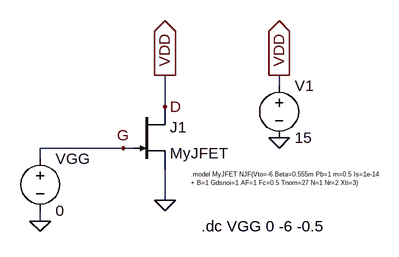
[diagram p0: schematic 004 JFET.asc]
004 JFET.asc, the LTspice schematic file:
Version 4
SHEET 1 2736 680
WIRE 352 0 352 -16
WIRE 176 32 176 -16
WIRE 112 96 -16 96
WIRE 128 96 112 96
WIRE -16 112 -16 96
WIRE 176 176 176 128
WIRE -16 208 -16 192
FLAG -16 208 0
FLAG 352 80 0
FLAG 176 32 D
FLAG 112 96 G
FLAG 176 176 0
FLAG 352 -16 VDD
IOPIN 352 -16 Out
FLAG 176 -16 VDD
IOPIN 176 -16 Out
SYMBOL voltage 352 -16 R0
SYMATTR InstName V1
SYMATTR Value 15
SYMBOL njf 128 32 R0
SYMATTR InstName J1
SYMATTR Value MyJFET
SYMBOL voltage -16 96 R0
SYMATTR InstName VGG
SYMATTR Value 0
TEXT 232 216 Left 2 !.dc VGG 0 -6 -0.5
TEXT 216 136 Left 0 !.model MyJFET NJF(Vto=-6 Beta=0.555m Pb=1 m=0.5 Is=1e-14\n+ B=1 Gdsnoi=1 AF=1 Fc=0.5 Tnom=27 N=1 Nr=2 Xti=3)

The netlist it stands for:
* 004 JFET.asc
V1 VDD 0 15
J1 VDD G 0 MyJFET
VGG G 0 0
.model NJF NJF
.model PJF PJF
.lib standard.jft
.dc VGG 0 -6 -0.5
.model MyJFET NJF(Vto=-6 Beta=0.555m Pb=1 m=0.5 Is=1e-14
+ B=1 Gdsnoi=1 AF=1 Fc=0.5 Tnom=27 N=1 Nr=2 Xti=3)
.backanno
.end